# Altium schematic sheet V2.SchDoc
size A2; PageSetup: Record=PageOptions|CenterHorizontal=True|CenterVertical=True|PrintScale=1.00|XCorrection=1.00|YCorrection=1.00|PrintKind=1|BorderSize=5000000|LeftOffset=0|BottomOffset=0|Orientation=2|PaperLength=1000|PaperWidth=1000|Scale=100|PaperSource=7|PrintQuality=-3|MediaType=1|DitherType=10|PrintScaleMode=1|PaperKind=A3 (297 x 420 mm)|PaperIndex=8
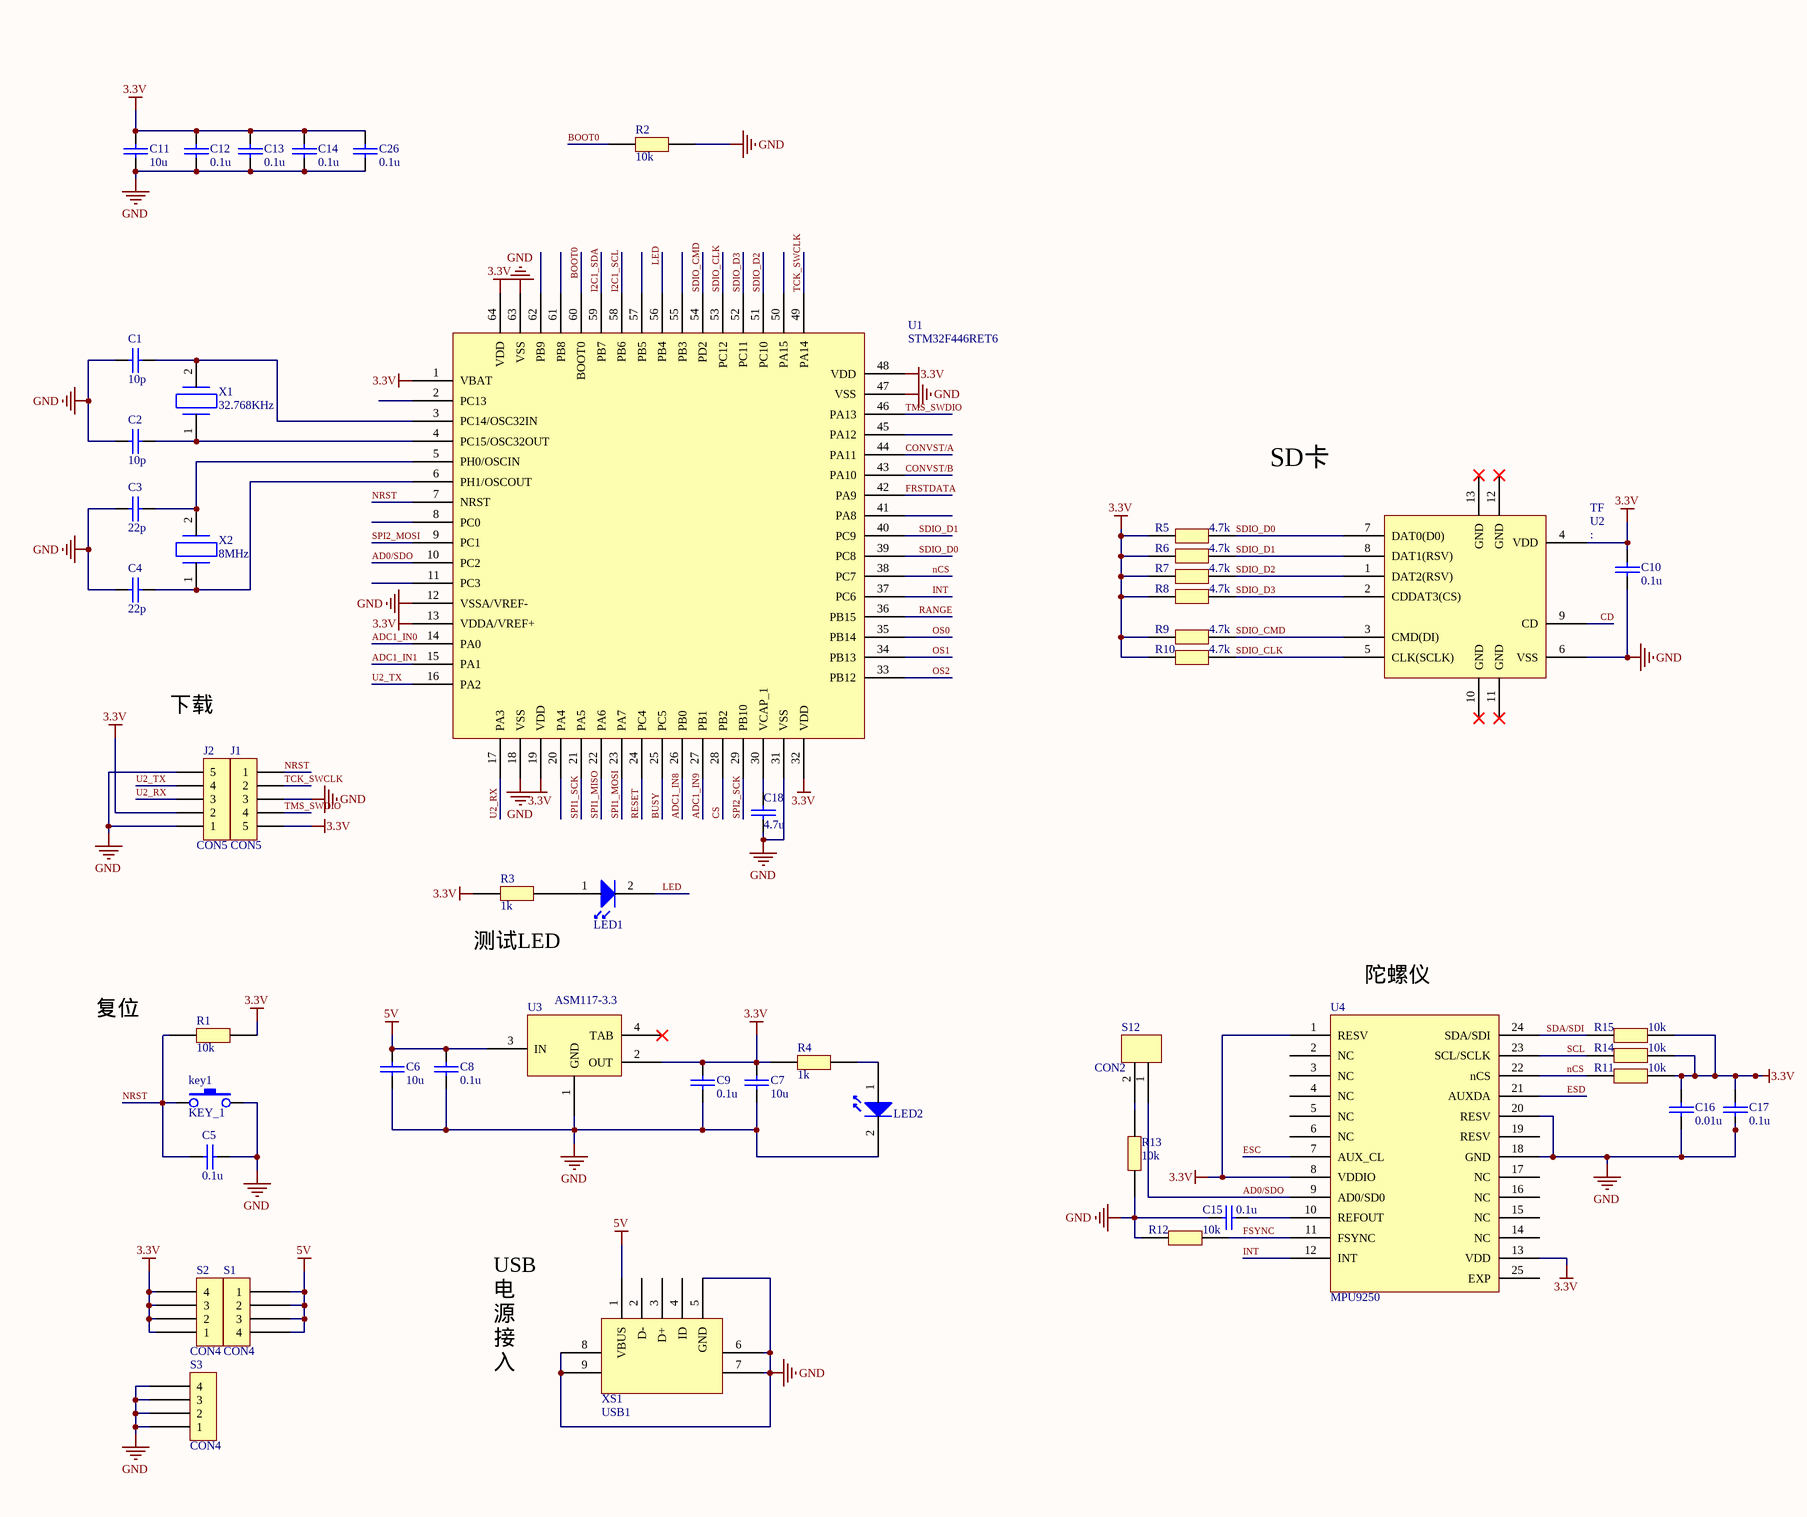
[diagram p0: V2.SchDoc, left]
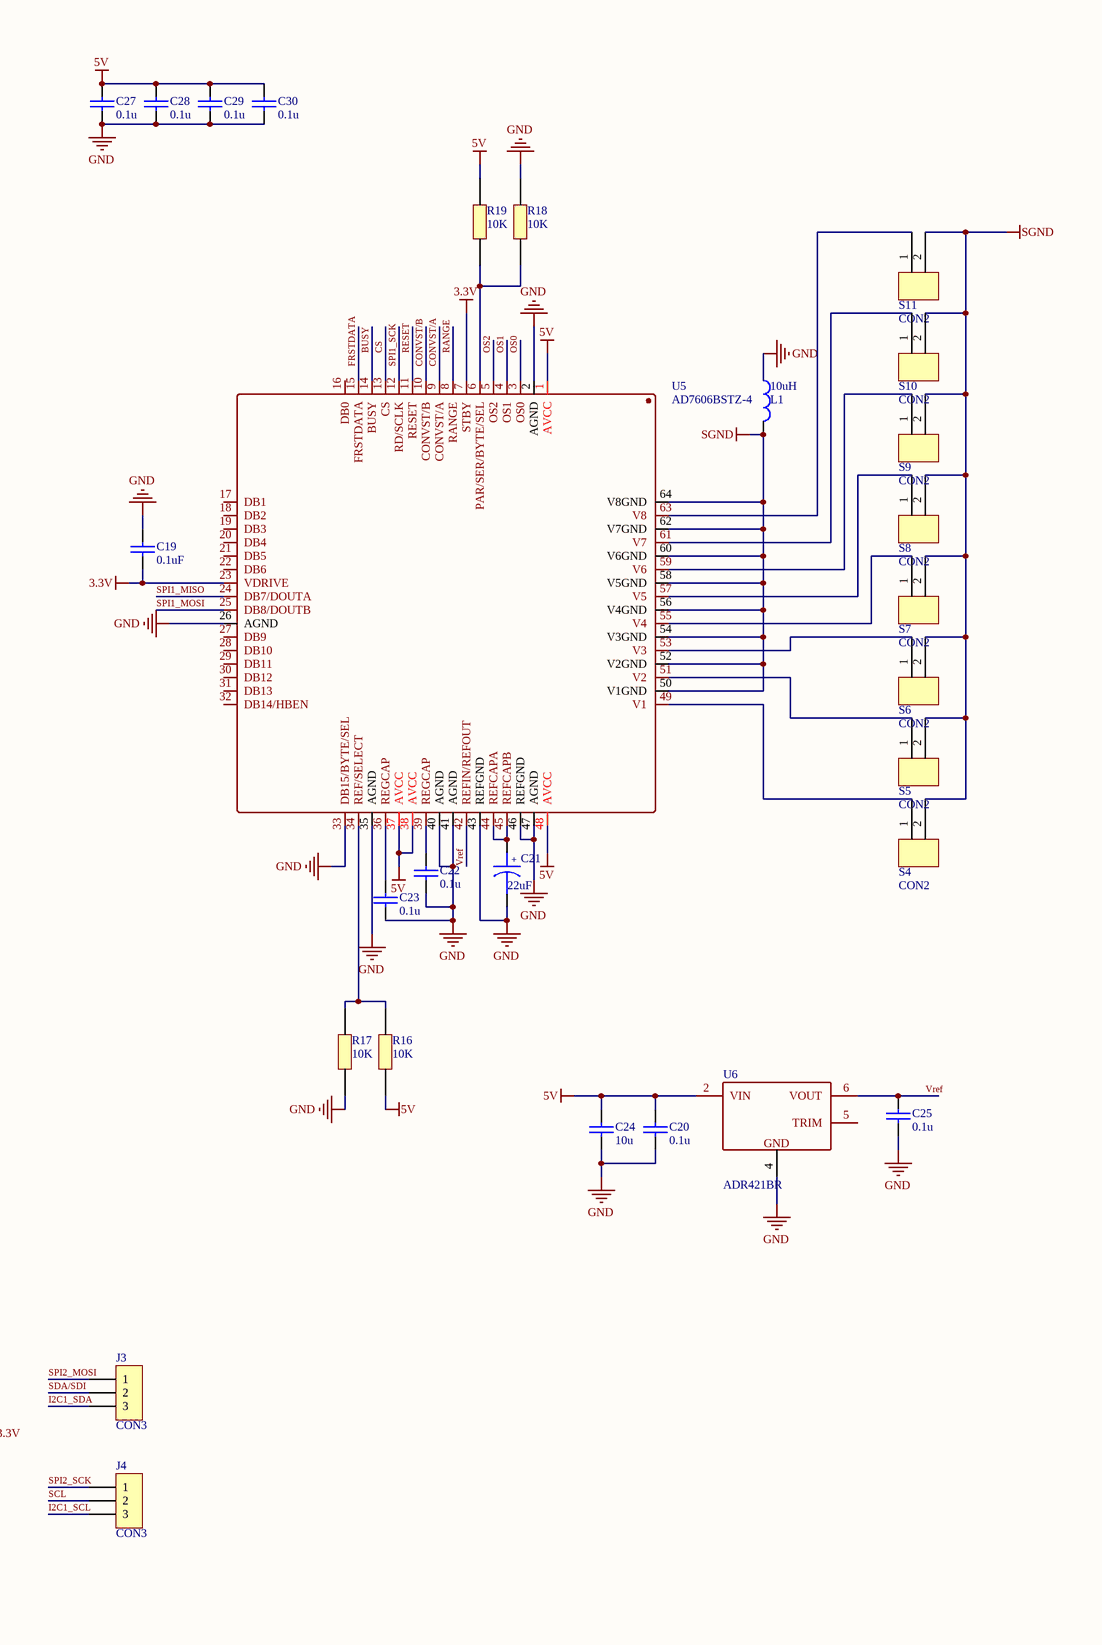
[diagram p1: V2.SchDoc, right]

## Parts
10uH  L1  [0805]
C1  10p  [0603-cap]
C2  10p  [0603-cap]
C3  22p  [0603-cap]
C4  22p  [0603-cap]
C5  0.1u  [0603-cap]
C6  10u  [0603-cap]
C7  10u  [0603-cap]
C8  0.1u  [0603-cap]
C9  0.1u  [0603-cap]
C10  0.1u  [0603-cap]
C11  10u  [0603-cap]
C12  0.1u  [0603-cap]
C13  0.1u  [0603-cap]
C14  0.1u  [0603-cap]
C15  0.1u  [0603-cap]
C16  0.01u  [0603-cap]
C17  0.1u  [0603-cap]
C18  4.7u  [0603-cap]
C19  0.1uF  [0603-cap]
C20  0.1u  [0603-cap]
C21  22uF  [C1206_Y]
C22  0.1u  [0603-cap]
C23  0.1u  [0603-cap]
C24  10u  [0603-cap]
C25  0.1u  [0603-cap]
C26  0.1u  [0603-cap]
C27  0.1u  [0603-cap]
C28  0.1u  [0603-cap]
C29  0.1u  [0603-cap]
C30  0.1u  [0603-cap]
J1  CON5  [SIP05]
J2  CON5  [SIP05]
J3  CON3  [SIP03]
J4  CON3  [SIP03]
key1  KEY_1  [key - duplicate5]
LED1  LED?  [LED]  (value not drawn)
LED2  LED?  [LED]  (value not drawn)
R1  10k  [0603-res]
R2  10k  [0603-res]
R3  1k  [0603-res]
R4  1k  [0603-res]
R5  4.7k  [0603-res]
R6  4.7k  [0603-res]
R7  4.7k  [0603-res]
R8  4.7k  [0603-res]
R9  4.7k  [0603-res]
R10  4.7k  [0603-res]
R11  10k  [0603-res]
R12  10k  [0603-res]
R13  10k  [0603-res]
R14  10k  [0603-res]
R15  10k  [0603-res]
R16  10K  [0603-res]
R17  10K  [0603-res]
R18  10K  [0603-res]
R19  10K  [0603-res]
S1  CON4  [SIP04]
S2  CON4  [SIP04]
S3  CON4  [SIP04]
S4  CON2  [SIP02]
S5  CON2  [SIP02]
S6  CON2  [SIP02]
S7  CON2  [SIP02]
S8  CON2  [SIP02]
S9  CON2  [SIP02]
S10  CON2  [SIP02]
S11  CON2  [SIP02]
S12  CON2  [SIP02]
TF  U2  [TF-01A]
U1  STM32F446RET6  [LQFP-64_10X10X05P]
U3  ASM117-3.3  [SOT-223]
U4  MPU9250  [QFN-24-1EP_3X3MM_PITCH0.4MM]
U5  AD7606BSTZ-4  [AD7606]
U6  ADR421BR  [ADR421]
X1  32.768KHz  [XTAL-B]
X2  8MHz  [XTAL2]
XS1  USB1  [micro USB]

## Nets
3.3V: C7.1 C9.1 C10.1 C11.1 C12.1 C13.1 C14.1 C16.2 C17.2 C19.1 C26.1 J1.5 J2.2 R1.1 R3.2 R4.1 R5.1 R6.1 R7.1 R8.1 R9.1 R10.1 R11.2 R14.2 R15.2 S2.1 S2.2 S2.3 S2.4 TF.4(VDD) U1.1(VBAT) U1.13(VDDA/VREF+) U1.19(VDD) U1.32(VDD) U1.48(VDD) U1.64(VDD) U3.2(OUT) U4.1(RESV) U4.8(VDDIO) U4.13(VDD) U5.7(STBY) U5.23(VDRIVE)
5V: C6.1 C8.1 C20.2 C24.1 C27.1 C28.1 C29.1 C30.1 R16.1 R19.2 S1.1 S1.2 S1.3 S1.4 U3.3(IN) U5.1(AVCC) U5.37(AVCC) U5.38(AVCC) U5.48(AVCC) U6.2(VIN) XS1.1(VBUS)
GND: 10uH.2 C1.1 C2.1 C3.1 C4.1 C5.2 C6.2 C7.2 C8.2 C9.2 C10.2 C11.2 C12.2 C13.2 C14.2 C15.1 C16.1 C17.1 C18.1 C19.2 C20.1 C21.2 C22.1 C23.2 C24.2 C25.2 C26.2 C27.2 C28.2 C29.2 C30.2 J1.3 J2.1 J2.5 key1.2 LED2.2 R2.1 R12.1 R13.1 R17.1 R18.2 S3.1 S3.2 S3.3 S3.4 TF.6(VSS) U1.12(VSSA/VREF-) U1.18(VSS) U1.31(VSS) U1.47(VSS) U1.63(VSS) U3.1(GND) U4.18(GND) U4.20(RESV) U5.2(AGND) U5.26(AGND) U5.33(DB15/BYTE/SEL) U5.35(AGND) U5.40(AGND) U5.41(AGND) U5.43(REFGND) U5.46(REFGND) U5.47(AGND) U6.4(GND) XS1.5(GND) XS1.6 XS1.7 XS1.8 XS1.9
SGND: 10uH.1 S4.2 S5.2 S6.2 S7.2 S8.2 S9.2 S10.2 S11.2 U5.50(V1GND) U5.52(V2GND) U5.54(V3GND) U5.56(V4GND) U5.58(V5GND) U5.60(V6GND) U5.62(V7GND) U5.64(V8GND)
AD0/SDO: S12.1 U1.10(PC2) U4.9(AD0/SD0)
ADC1_IN0: U1.14(PA0)
ADC1_IN1: U1.15(PA1)
ADC1_IN8: U1.26(PB0)
ADC1_IN9: U1.27(PB1)
BOOT0: R2.2 U1.60(BOOT0)
BUSY: U1.25(PC5) U5.14(BUSY)
CD: TF.9(CD)
CONVST/A: U1.44(PA11) U5.9(CONVST/A)
CONVST/B: U1.43(PA10) U5.10(CONVST/B)
CS: U1.28(PB2) U5.13(CS)
ESC: U4.7(AUX_CL)
ESD: U4.21(AUXDA)
FRSTDATA: U1.42(PA9) U5.15(FRSTDATA)
FSYNC: R12.2 U4.11(FSYNC)
I2C1_SCL: J4.3 U1.58(PB6)
I2C1_SDA: J3.3 U1.59(PB7)
INT: U1.37(PC6) U4.12(INT)
LED: LED1.2 U1.56(PB4)
nCS: R11.1 U1.38(PC7) U4.22(nCS)
NRST: C5.1 J1.1 key1.1 R1.2 U1.7(NRST)
OS0: U1.35(PB14) U5.3(OS0)
OS1: U1.34(PB13) U5.4(OS1)
OS2: U1.33(PB12) U5.5(OS2)
RANGE: U1.36(PB15) U5.8(RANGE)
RESET: U1.24(PC4) U5.11(RESET)
SCL: J4.2 R14.1 U4.23(SCL/SCLK)
SDA/SDI: J3.2 R15.1 U4.24(SDA/SDI)
SDIO_CLK: R10.2 TF.5(CLK(SCLK)) U1.53(PC12)
SDIO_CMD: R9.2 TF.3(CMD(DI)) U1.54(PD2)
SDIO_D0: R5.2 TF.7(DAT0(D0)) U1.39(PC8)
SDIO_D1: R6.2 TF.8(DAT1(RSV)) U1.40(PC9)
SDIO_D2: R7.2 TF.1(DAT2(RSV)) U1.51(PC10)
SDIO_D3: R8.2 TF.2(CDDAT3(CS)) U1.52(PC11)
SPI1_MISO: U1.22(PA6) U5.24(DB7/DOUTA)
SPI1_MOSI: U1.23(PA7) U5.25(DB8/DOUTB)
SPI1_SCK: U1.21(PA5) U5.12(RD/SCLK)
SPI2_MOSI: J3.1 U1.9(PC1)
SPI2_SCK: J4.1 U1.29(PB10)
TCK_SWCLK: J1.2 U1.49(PA14)
TMS_SWDIO: J1.4 U1.46(PA13)
U2_RX: J2.3 U1.17(PA3)
U2_TX: J2.4 U1.16(PA2)
Vref: C25.1 U5.42(REFIN/REFOUT) U6.6(VOUT)
NetC1_2: C1.2 U1.3(PC14/OSC32IN) X1.2
NetC2_2: C2.2 U1.4(PC15/OSC32OUT) X1.1
NetC3_2: C3.2 U1.5(PH0/OSCIN) X2.2
NetC4_2: C4.2 U1.6(PH1/OSCOUT) X2.1
NetC15_2: C15.2 U4.10(REFOUT)
NetC18_2: C18.2 U1.30(VCAP_1)
NetC21_1: C21.1 U5.44(REFCAPA) U5.45(REFCAPB)
NetC22_2: C22.2 U5.39(REGCAP)
NetC23_1: C23.1 U5.36(REGCAP)
NetLED1_1: LED1.1 R3.1
NetLED2_1: LED2.1 R4.2
NetR13_2: R13.2 S12.2
NetR16_2: R16.2 R17.2 U5.34(REF/SELECT)
NetR18_1: R18.1 R19.1 U5.6(PAR/SER/BYTE/SEL)
NetS4_1: S4.1 U5.49(V1)
NetS5_1: S5.1 U5.51(V2)
NetS6_1: S6.1 U5.53(V3)
NetS7_1: S7.1 U5.55(V4)
NetS8_1: S8.1 U5.57(V5)
NetS9_1: S9.1 U5.59(V6)
NetS10_1: S10.1 U5.61(V7)
NetS11_1: S11.1 U5.63(V8)

Not connected (* = marked no-connect by the designer): TF 10(GND)* 11(GND)* 12(GND)* 13(GND)*; U1 2(PC13) 8(PC0) 11(PC3) 20(PA4) 41(PA8) 45(PA12) 50(PA15) 55(PB3) 57(PB5) 61(PB8) 62(PB9); U3 4(TAB)*; U4 2(NC) 3(NC) 4(NC) 5(NC) 6(NC) 14(NC) 15(NC) 16(NC) 17(NC) 19(RESV) 25(EXP); U5 16(DB0) 17(DB1) 18(DB2) 19(DB3) 20(DB4) 21(DB5) 22(DB6) 27(DB9) 28(DB10) 29(DB11) 30(DB12) 31(DB13) 32(DB14/HBEN); U6 5(TRIM); XS1 2(D-) 3(D+) 4(ID)

## Notes on the sheet
- SD卡
- DB15接地选择SPI接口，接高电平选8位并行接口
- 下载
- (near C18) C18不接，让VCAP_1悬空
  （网友：2.2u；手册4.7u）
- 测试LED
- (near U4) 陀螺仪
- (near R1) 复位
- (near R13) R13不接，用SPI方式不能接地；10K
- USB电源接入
- (in symbol 电解电容) +

## Library data of the parts
10uH = L
C1-C20 C22-C30 = CAP
C21 = 电解电容: Capacitor
LED1 LED2 = LED
R1-R19 = RES
TF = TF-01A
U6 = ADR421
X1 X2 = XTAL